# EAGLE design contactless-thermometer (EAGLE 9.6.2)
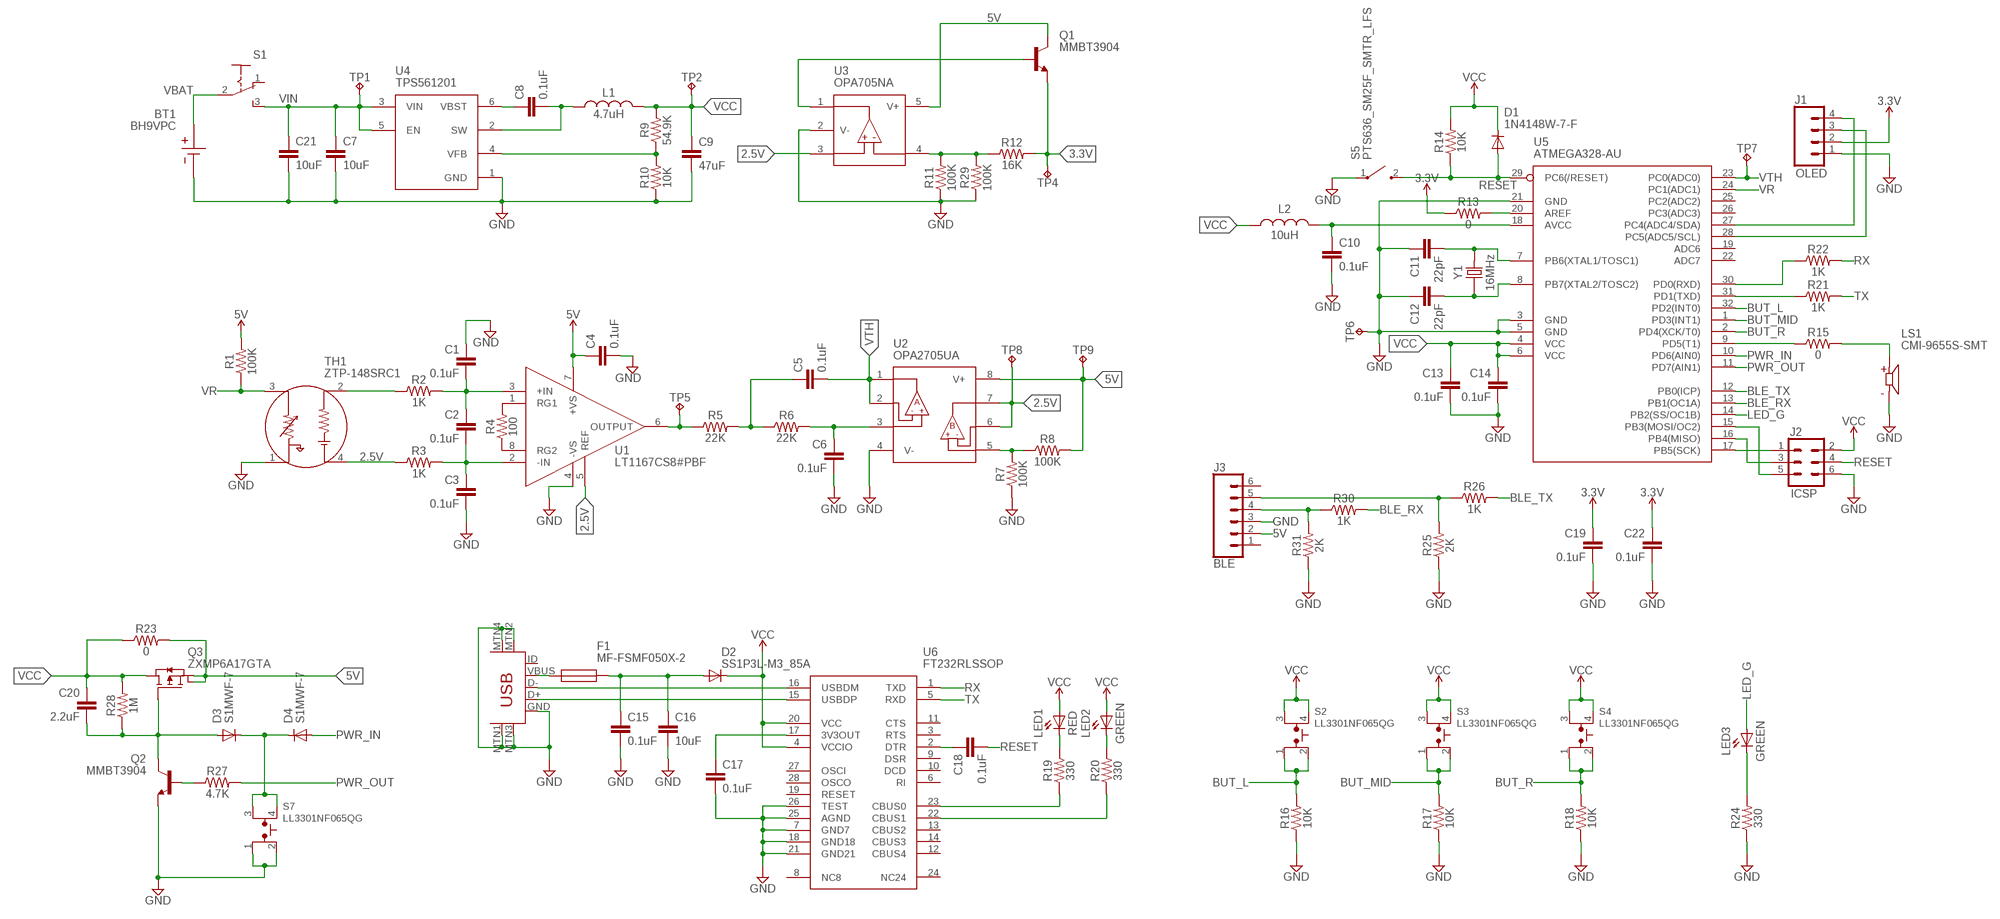
[diagram p0: schematic, sheet 1]

## Parts
BT1  BH9VPC  [BAT_BH9VPC]
C1  0.1uF  0.1UF-0603-25V-(+80/-20%)  [0603]
C2  0.1uF  0.1UF-0603-25V-(+80/-20%)  [0603]
C3  0.1uF  0.1UF-0603-25V-(+80/-20%)  [0603]
C4  0.1uF  0.1UF-0603-25V-(+80/-20%)  [0603]
C5  0.1uF  0.1UF-0603-25V-(+80/-20%)  [0603]
C6  0.1uF  0.1UF-0603-25V-(+80/-20%)  [0603]
C7  10uF  GRM21BR6YA106KE43L  [CAPC2012X145N]
C8  0.1uF  0.1UF-0603-25V-(+80/-20%)  [0603]
C9  47uF  10UF-1206-6.3V-20%  [1206]
C10  0.1uF  0.1UF-0603-25V-(+80/-20%)  [0603]
C11  22pF  0.1UF-0603-25V-(+80/-20%)  [0603]
C12  22pF  0.1UF-0603-25V-(+80/-20%)  [0603]
C13  0.1uF  0.1UF-0603-25V-(+80/-20%)  [0603]
C14  0.1uF  0.1UF-0603-25V-(+80/-20%)  [0603]
C15  0.1uF  0.1UF-0603-25V-(+80/-20%)  [0603]
C16  10uF  10UF-1206-6.3V-20%  [1206]
C17  0.1uF  0.1UF-0603-25V-(+80/-20%)  [0603]
C18  0.1uF  0.1UF-0603-25V-(+80/-20%)  [0603]
C19  0.1uF  0.1UF-0603-25V-(+80/-20%)  [0603]
C20  2.2uF  GRM21BR6YA106KE43L  [CAPC2012X145N]
C21  10uF  GRM21BR6YA106KE43L  [CAPC2012X145N]
C22  0.1uF  0.1UF-0603-25V-(+80/-20%)  [0603]
D1  1N4148W-7-F  [SOD3716X145N]
D2  SS1P3L-M3_85A  [SMP]
D3  S1MWF-7  [SODFL3518X115N]
D4  S1MWF-7  [SODFL3518X115N]
F1  MF-FSMF050X-2  [FUSC1608X100N]
J1  OLED  CONN_04  [1X04]
J2  ICSP  CONN_03X22X3_SILK_MALE_PTH  [2X3]
J3  BLE  CONN_06SILK_FEMALE_PTH  [1X06]
J4  USB-MINIB-5PIN  [USB-MINIB]
L1  4.7uH  VLCF5020T-4R7N1R7-1  [VLCF5020T4R7N1R71]
L2  10uH  LBC2012T100K  [INDC2012X145N]
LED1  RED  AA1608CGSK  [AA1608CGSK]
LED2  GREEN  AA1608CGSK  [AA1608CGSK]
LED3  GREEN  AA1608CGSK  [AA1608CGSK]
LS1  CMI-9655S-SMT  [CUI_CMI-9655S-SMT]
Q1  MMBT3904  [SOT23_NXP]
Q2  MMBT3904  [SOT23_NXP]
Q3  ZXMP6A17GTA  [SOT230P700X180-4N]
R1  100K  RESISTOR0603  [0603]
R2  1K  RESISTOR0603  [0603]
R3  1K  RESISTOR0603  [0603]
R4  100  RESISTOR0603  [0603]
R5  22K  RESISTOR0603  [0603]
R6  22K  RESISTOR0603  [0603]
R7  100K  RESISTOR0603  [0603]
R8  100K  RESISTOR0603  [0603]
R9  54.9K  RESISTOR0603  [0603]
R10  10K  RESISTOR0603  [0603]
R11  100K  RESISTOR0603  [0603]
R12  16K  RESISTOR0603  [0603]
R13  0  RESISTOR0603  [0603]
R14  10K  RESISTOR0603  [0603]
R15  0  RESISTOR0603  [0603]
R16  10K  RESISTOR0603  [0603]
R17  10K  RESISTOR0603  [0603]
R18  10K  RESISTOR0603  [0603]
R19  330  RESISTOR0603  [0603]
R20  330  RESISTOR0603  [0603]
R21  1K  RESISTOR0603  [0603]
R22  1K  RESISTOR0603  [0603]
R23  0  RESISTOR0603  [0603]
R24  330  RESISTOR0603  [0603]
R25  2K  RESISTOR0603  [0603]
R26  1K  RESISTOR0603  [0603]
R27  4.7K  RESISTOR0603  [0603]
R28  1M  RESISTOR0603  [0603]
R29  100K  RESISTOR0603  [0603]
R30  1K  RESISTOR0603  [0603]
R31  2K  RESISTOR0603  [0603]
S1  SK12F17G7  [SW3_2F17G7_CNK]
S2  LL3301NF065QG  [LL3301NF065QG]
S3  LL3301NF065QG  [LL3301NF065QG]
S4  LL3301NF065QG  [LL3301NF065QG]
S5  PTS636_SM25F_SMTR_LFS  [PTS636SM25FSMTRLFS]
S7  LL3301NF065QG  [LL3301NF065QG]
TH1  ZTP-148SRC1  [XDCR_ZTP-148SRC1]
TP1  TPTP10R  [TP10R]
TP2  TPTP10R  [TP10R]
TP4  TPTP10R  [TP10R]
TP5  TPTP10R  [TP10R]
TP6  TPTP10R  [TP10R]
TP7  TPTP10R  [TP10R]
TP8  TPTP10R  [TP10R]
TP9  TPTP10R  [TP10R]
U1  LT1167CS8#PBF  [SOIC127P599X175-8N]
U2  OPA2705UA  [SOIC127P600X175-8N]
U3  OPA705NA  OPA705NA_3K  [SOT95P280X145-5N]
U4  TPS561201  TPS561201DDCR  [SOT95P280X110-6N]
U5  ATMEGA328-AU  MEGA8-AI  [TQFP32-08]
U6  FT232RLSSOP  [SOP65P780X200-28N]
Y1  16MHz  ECS-240-20-5PX-TR  [XTAL_ECS-240-20-5PX-TR]

## Nets
2.5V: R3.1 TH1.4(THERMOPILE_GND) TP8.TP U1.5(REF) U2.6(-INB) U2.7(OUTB) U3.3(+IN)
3.3V: C19.1 C22.1 J1.2 Q1.2 R12.2 R13.1 TP4.TP
5V: C4.1 J3.2 Q1.3 Q3.2(D1) Q3.4(D2) R1.2 R8.2 R23.2 TP9.TP U1.7(+VS) U2.8(V+) U3.5(V+)
AVCC: C10.1 L2.2 U5.18(AVCC)
BLE_RX: R30.2 U5.13(PB1(OC1A))
BLE_TX: R26.2 U5.12(PB0(ICP))
BUT_L: R16.2 S2.1 S2.2 U5.32(PD2(INT0))
BUT_MID: R17.2 S3.1 S3.2 U5.1(PD3(INT1))
BUT_R: R18.2 S4.1 S4.2 U5.2(PD4(XCK/T0))
BUZZ: R15.1 U5.9(PD5(T1))
DTR: C18.1 U6.2(DTR)
GND: BT1.- C1.1 C3.2 C4.2 C6.2 C7.1 C9.2 C10.2 C11.1 C12.1 C13.2 C14.2 C15.2 C16.2 C17.2 C19.2 C21.1 C22.2 J1.1 J2.6 J3.3 J4.GND J4.MTN1(MTN2) J4.MTN2(MTN3) J4.MTN3(MTN1) J4.MTN4 LS1.N Q2.2 R7.1 R10.1 R11.1 R16.1 R17.1 R18.1 R24.1 R25.1 R29.1 R31.1 S5.1(COM) S7.1 S7.2 TH1.1(THERMISTOR_GND) TP6.TP U1.4(-VS) U2.4(V-) U3.2(V-) U4.1(GND) U5.3(GND) U5.5(GND) U5.21(GND) U6.7(GND7) U6.18(GND18) U6.21(GND21) U6.25(AGND) U6.26(TEST)
LED_G: LED3.2(A) U5.14(PB2(SS/OC1B))
N$1: C1.2 C2.1 R2.2 U1.3(+IN)
N$2: R4.2 U1.1(RG1)
N$3: R2.1 TH1.2(THERMOPILE)
N$5: C2.2 C3.1 R3.2 U1.2(-IN)
N$6: R7.2 R8.1 U2.5(+INB)
N$7: R4.1 U1.8(RG2)
N$8: R5.1 TP5.TP U1.6(OUTPUT)
N$9: LS1.P R15.2
N$10: C5.1 R5.2 R6.1
N$11: C6.1 R6.2 U2.3(+INA)
N$12: R13.2 U5.20(AREF)
N$13: J4.D- U6.16(USBDM)
N$14: J4.D+ U6.15(USBDP)
N$15: J2.1 U5.17(PB5(SCK))
N$16: C8.1 U4.6(VBST)
N$17: C11.2 U5.7(PB6(XTAL1/TOSC1)) Y1.2
N$18: C12.2 U5.8(PB7(XTAL2/TOSC2)) Y1.1
N$19: J2.3 U5.16(PB4(MISO))
N$20: C8.2 L1.1 U4.2(SW)
N$21: J2.5 U5.15(PB3(MOSI/OC2))
N$22: R9.1 R10.2 U4.4(VFB)
N$23: R11.2 R12.1 R29.2 U3.4(-IN)
N$24: R19.1 U6.23(CBUS0)
N$25: J1.4 U5.27(PC4(ADC4/SDA))
N$26: LED1.1(K) R19.2
N$27: R20.1 U6.22(CBUS1)
N$28: J1.3 U5.28(PC5(ADC5/SCL))
N$29: LED2.1(K) R20.2
N$30: C17.1 U6.17(3V3OUT)
N$31: F1.1 J4.VBUS
N$32: Q1.1 U3.1(OUT)
N$33: C15.1 C16.1 D2.1(A) F1.2
N$34: R21.1 U5.31(PD1(TXD))
N$35: R22.1 U5.30(PD0(RXD))
N$36: J3.4 R30.1 R31.2
N$37: Q2.1 R27.1
N$38: LED3.1(K) R24.2
N$39: J3.5 R25.2 R26.1
N$44: C20.1 D3.2(A) Q2.3 Q3.1(G) R28.1
N$45: D3.1(K) D4.1(K) S7.3 S7.4
PWR_IN: D4.2(A) U5.10(PD6(AIN0))
PWR_OUT: R27.2 U5.11(PD7(AIN1))
RESET: C18.2 D1.2(A) J2.4 R14.1 S5.2(NO) U5.29(PC6(/RESET))
RX: R22.2 U6.1(TXD)
TX: R21.2 U6.5(RXD)
VBAT: BT1.+ S1.2
VCC: C9.1 C13.1 C14.1 C20.2 D1.1(K) D2.2(K) J2.2 L1.2 L2.1 LED1.2(A) LED2.2(A) Q3.3(S) R9.2 R14.2 R23.1 R28.2 S2.3 S2.4 S3.3 S3.4 S4.3 S4.4 TP2.TP U5.4(VCC) U5.6(VCC) U6.4(VCCIO) U6.20(VCC)
VIN: C7.2 C21.2 S1.3 TP1.TP U4.3(VIN) U4.5(EN)
VR: R1.1 TH1.3(THERMISTOR) U5.24(PC1(ADC1))
VTH: C5.2 TP7.TP U2.1(OUTA) U2.2(-INA) U5.23(PC0(ADC0))
Unconnected: J3.1 J3.6 J4.ID S1.1 U5.19(ADC6) U5.22(ADC7) U5.25(PC2(ADC2)) U5.26(PC3(ADC3)) U6.3(RTS) U6.6(RI) U6.8(NC8) U6.9(DSR) U6.10(DCD) U6.11(CTS) U6.12(CBUS4) U6.13(CBUS2) U6.14(CBUS3) U6.19(RESET) U6.24(NC24) U6.27(OSCI) U6.28(OSCO)

## Library data of the parts
BT1 = BH9VPC:BH9VPC: 9V Battery Holder; DESCRIPTION: Battery Holder (Open) 9V 1 Cell PC Pin; DIGI-KEY_PART_NUMBER: BH9V-PC-ND; MF: MPD; MP: BH9VPC; PACKAGE: None; PURCHASE-URL: https://pricing.snapeda.com/search/part/BH9VPC/?ref=eda
C1-C6 C8 C10 C13-C15 C17-C19 C22 = SparkFun-Capacitors:0.1UF: 0.1µF ceramic capacitors A capacitor is a passive two-terminal electrical component used to store electrical energy temporarily in an electric field.; PROD_ID: CAP-00810
C7 C20 C21 = GRM21BR6YA106KE43L:GRM21BR6YA106KE43L: Check prices <https://pricing.snapeda.com/parts/GRM21BR6YA106KE43L/Murata/view-part?ref=eda>; AVAILABILITY: Good; DESCRIPTION: 0805 35 V 10 uF ±10% Tolerance X5R Multilayer Ceramic Capacitor; MF: Murata; MP: GRM21BR6YA106KE43L; PACKAGE: 2012 Murata; PRICE: None; PURCHASE-URL: https://pricing.snapeda.com/search/part/GRM21BR6YA106KE43L/?ref=eda
C9 = SparkFun-Capacitors:10UF: 10.0µF ceramic capacitors A capacitor is a passive two-terminal electrical component used to store electrical energy temporarily in an electric field.; PROD_ID: CAP-10057; VALUE: 10uF
C11 C12 = SparkFun-Capacitors:0.1UF: 0.1µF ceramic capacitors A capacitor is a passive two-terminal electrical component used to store electrical energy temporarily in an electric field.; PROD_ID: CAP-00810; VALUE: 0.1uF
C16 = SparkFun-Capacitors:10UF: 10.0µF ceramic capacitors A capacitor is a passive two-terminal electrical component used to store electrical energy temporarily in an electric field.; PROD_ID: CAP-10057
D1 = SamacSys_Parts:1N4148W-7-F: Diode Switching 150mA 100V 400mW SOD123 Diodes Inc 1N4148W-7-F Switching Diode 100V, 2-Pin SOD-123 Source: Datasheet <https://componentsearchengine.com/Datasheets/2/1N4148W-7-F.pdf>; DESCRIPTION: Diode Switching 150mA 100V 400mW SOD123 Diodes Inc 1N4148W-7-F Switching Diode 100V, 2-Pin SOD-123; HEIGHT: 1.45mm; MANUFACTURER_NAME: Diodes Inc.; MANUFACTURER_PART_NUMBER: 1N4148W-7-F; MOUSER_PART_NUMBER: 621-1N4148W-F; MOUSER_PRICE-STOCK: https://www.mouser.co.uk/ProductDetail/Diodes-Incorporated/1N4148W-7-F?qs=LHX0FizJzg7Ae9ZM8LTAWw%3D%3D
D2 = SamacSys_Parts:SS1P3L-M3_85A: Schottky Diodes & Rectifiers 30volt 1.0amp Source: Datasheet <https://www.vishay.com/docs/88915/ss1p3l.pdf>; DESCRIPTION: Schottky Diodes & Rectifiers 30volt 1.0amp; HEIGHT: mm; MANUFACTURER_NAME: Vishay; MANUFACTURER_PART_NUMBER: SS1P3L-M3/85A; MOUSER_PART_NUMBER: 625-SS1P3L-M3/85A; MOUSER_PRICE-STOCK: https://www.mouser.co.uk/ProductDetail/Vishay-General-Semiconductor/SS1P3L-M3-85A?qs=HSPD0Bff7iYLtqq1%2F0B2Eg%3D%3D
D3 D4 = SamacSys_Parts:S1MWF-7: Diode Switching 1KV 1A Automotive 2-Pin SOD-123F T/R Source: Datasheet <https://www.arrow.com/en/products/s1mwf-7/diodes-incorporated>; DESCRIPTION: Diode Switching 1KV 1A Automotive 2-Pin SOD-123F T/R; HEIGHT: 1.15mm; MANUFACTURER_NAME: Diodes Inc.; MANUFACTURER_PART_NUMBER: S1MWF-7; MOUSER_PART_NUMBER: 621-S1MWF-7; MOUSER_PRICE-STOCK: https://www.mouser.co.uk/ProductDetail/Diodes-Incorporated/S1MWF-7?qs=s5XU71A7K7%2FWPoeHvtFM6A%3D%3D
F1 = SamacSys_Parts:MF-FSMF050X-2: 0603 PTC Resettable Fuses, 6V, 500mA Bourns 0.5A Surface Mount Resettable Fuse, 6 V Source: Datasheet; DESCRIPTION: 0603 PTC Resettable Fuses, 6V, 500mA Bourns 0.5A Surface Mount Resettable Fuse, 6 V; HEIGHT: 1mm; MANUFACTURER_NAME: Bourns; MANUFACTURER_PART_NUMBER: MF-FSMF050X-2; MOUSER_PART_NUMBER: 652-MFFSMF050X-2; MOUSER_PRICE-STOCK: https://www.mouser.co.uk/ProductDetail/Bourns/MF-FSMF050X-2?qs=3QkGRBNOvbrZekaW8Gqm4A%3D%3D
J1 = SparkFun-Connectors:CONN_04: Multi connection point. Often used as Generic Header-pin footprint for 0.1 inch spaced/style header connections On any of the 0.1 inch spaced packages, you can populate with these: Break Away Headers - Straight <https://www.sparkfun.com/products/116> (PRT-00116) Break Away Male Headers - Right Angle <https://www.sparkfun.com/products/553> (PRT-00553) Female Headers <https://www.sparkfun.com/products/115> (PRT-00115) Break Away Headers - Machine Pin <https://www.sparkfun.com/products/117> (PRT-00117) Break Away Female Headers - Swiss Machine Pin <https://www.sparkfun.com/products/743> (PRT-00743) For SCREWTERMINALS and SPRING TERMINALS visit here: Screw Terimnals on SparkFun.com <https://www.sparkfun.com/search/results?term=Screw+Terminals> (5mm/3.5mm/2.54mm spacing) This device is also useful as a general connection point to wire up your design to another part of your project. Our various solder wires solder well into these plated through hole pads. Hook-Up Wire - Assortment (Stranded, 22 AWG) <https://www.sparkfun.com/products/11375> (PRT-11375) Hook-Up Wire - Assortment (Solid Core, 22 AWG) <https://www.sparkfun.com/products/11367> (PRT-11367) View the entire wire category on our website here <https://www.sparkfun.com/categories/141> Special notes: Molex polarized connector foot print use with SKU : PRT-08231 with associated crimp pins and housings. 1MM SMD Version SKU: PRT-10208; PROD_ID: CONN-09696
J2 = SparkFun-Connectors:CONN_03X2: Multi connection point. Often used as Generic Header-pin footprint for 0.1 inch spaced/style header connections You can populate with any combo of single row headers, but if you'd like an exact match, check these: Header - 2x3 (Male, 0.1") <https://www.sparkfun.com/products/12807> (PRT-12807) Header - 2x3 (Female, 0.1") <https://www.sparkfun.com/products/13010> (PRT-13010) 2x3 Pin Shrouded Header <https://www.sparkfun.com/products/10877> (PRT-10877) On any of the 0.1 inch spaced packages, you can populate with these: Break Away Headers - Straight <https://www.sparkfun.com/products/116> (PRT-00116) Break Away Male Headers - Right Angle <https://www.sparkfun.com/products/553> (PRT-00553) Female Headers <https://www.sparkfun.com/products/115> (PRT-00115) Break Away Headers - Machine Pin <https://www.sparkfun.com/products/117> (PRT-00117) Break Away Female Headers - Swiss Machine Pin <https://www.sparkfun.com/products/743> (PRT-00743) Special note: the shrouded connector mates well with our 3x2 ribbon cables: Ribbon Crimp Connector - 6-pin (2x3, Female) <https://www.sparkfun.com/products/10651> (PRT-10651) Ribbon Cable - 6 wire (15ft) <https://www.sparkfun.com/products/10646> (PRT-10646); PROD_ID: CONN-09701
J3 = SparkFun-Connectors:CONN_06: Multi connection point. Often used as Generic Header-pin footprint for 0.1 inch spaced/style header connections On any of the 0.1 inch spaced packages, you can populate with these: Break Away Headers - Straight <https://www.sparkfun.com/products/116> (PRT-00116) Break Away Male Headers - Right Angle <https://www.sparkfun.com/products/553> (PRT-00553) Female Headers <https://www.sparkfun.com/products/115> (PRT-00115) Break Away Headers - Machine Pin <https://www.sparkfun.com/products/117> (PRT-00117) Break Away Female Headers - Swiss Machine Pin <https://www.sparkfun.com/products/743> (PRT-00743) Arduino Stackable Header - 6 Pin <https://www.sparkfun.com/products/9280> (PRT-09280) For SCREWTERMINALS and SPRING TERMINALS visit here: Screw Terimnals on SparkFun.com <https://www.sparkfun.com/search/results?term=Screw+Terminals> (5mm/3.5mm/2.54mm spacing) This device is also useful as a general connection point to wire up your design to another part of your project. Our various solder wires solder well into these plated through hole pads. Hook-Up Wire - Assortment (Stranded, 22 AWG) <https://www.sparkfun.com/products/11375> (PRT-11375) Hook-Up Wire - Assortment (Solid Core, 22 AWG) <https://www.sparkfun.com/products/11367> (PRT-11367) View the entire wire category on our website here <https://www.sparkfun.com/categories/141>; PROD_ID: CONN-08437
J4 = SparkFun:USB-MINIB: Mini-USB "B" connector with 5th pin broken out. Created new symbol breaking out 5th "ID" pin in mini/micro USB connector spec. See: http://en.wikipedia.org/wiki/Mini_usb#Cables. Uses same footprint as 4-pin symbol. Also added pins to connect to mounting / shield pads if required (probably not generally needed as signals aren't shielded once they leave the connector).
L1 = SamacSys_Parts:VLCF5020T-4R7N1R7-1: TDK VLC5020 Series Shielded Wire-wound SMD Inductor 4.7 uH +/-30% 2.09A Idc Source: Datasheet <https://componentsearchengine.com/Datasheets/1/VLCF5020T-4R7N1R7-1.pdf>; DESCRIPTION: TDK VLC5020 Series Shielded Wire-wound SMD Inductor 4.7 uH +/-30% 2.09A Idc; HEIGHT: 2mm; MANUFACTURER_NAME: TDK; MANUFACTURER_PART_NUMBER: VLCF5020T-4R7N1R7-1; MOUSER_PART_NUMBER: 810-VLCF52T4R7N1R71; MOUSER_PRICE-STOCK: https://www.mouser.co.uk/ProductDetail/TDK/VLCF5020T-4R7N1R7-1?qs=9dFQwQorgSwYqTIMbazytg%3D%3D
L2 = LBC2012T100K:LBC2012T100K: INDUCTOR, 10UH, 0.2A, 10%, 40MHz; Product Range:TAIYO YUDEN - LBC Series 2012 (0805) Wirewound Chip Inductors; Inductance:10µH; Inductance Tolerance:± 10%; DC Resistance Max:1.2ohm; DC Current Rating:200mA; Inductor Case Style:0805 ;RoHS Compliant: Yes; DESCRIPTION: 10µH Unshielded Wirewound Inductor 200mA 1.2Ohm 0805 (2012 Metric); DIGI-KEY_PART_NUMBER: 587-2530-1-ND; MF: Taiyo Yuden; MP: LBC2012T100K; PACKAGE: 2012 Taiyo Yuden
LED1-LED3 = SamacSys_Parts:AA1608CGSK: Standard LEDs - SMD Green LED Source: Datasheet; DESCRIPTION: Standard LEDs - SMD Green LED; HEIGHT: 0.65mm; MANUFACTURER_NAME: Kingbright; MANUFACTURER_PART_NUMBER: AA1608CGSK; MOUSER_PART_NUMBER: 604-AA1608CGSK; MOUSER_PRICE-STOCK: https://www.mouser.co.uk/ProductDetail/Kingbright/AA1608CGSK?qs=eP2BKZSCXI5BYF2DjL8nRw%3D%3D
LS1 = CMI-9655S-SMT:CMI-9655S-SMT: 9.6 mm, 5 Vdc, 85 dB, 2.7 kHz, Surface Mount (SMT), Driving Circuit, Magnetic Audio Indicator Buzzer Check prices <https://pricing.snapeda.com/parts/CMI-9655S-SMT-TR/CUI%20Devices/view-part?ref=eda>; AVAILABILITY: Good; CUI_PURCHASE_URL: https://www.cuidevices.com/product/audio/buzzers/audio-indicators/cmi-9655s-smt-tr?utm_source=snapeda.com&utm_medium=referral&utm_campaign=snapedaBOM; DESCRIPTION: 9.6 mm, 5 Vdc, 85 dB, 2.7 kHz, Surface Mount (SMT), Driving Circuit, Magnetic Audio Indicator Buzzer; MF: CUI Devices; MP: CMI-9655S-SMT-TR; PACKAGE: CUI Inc.; PRICE: None; PURCHASE-URL: https://pricing.snapeda.com/search/part/CMI-9655S-SMT-TR/?ref=eda
Q1 Q2 = MMBT3904:MMBT3904; BUILT_BY: EMA_UL_Team; MANUFACTURER_PART_NUMBER: MMBT3904; SOURCELIBRARY: NXP_2011-11-10; VENDOR: NXP
Q3 = SamacSys_Parts:ZXMP6A17GTA: ZXMP6A17GTA P-Channel MOSFET, 4.3 A, 60 V, 3 + Tab-Pin SOT-223 Diodes Inc Source: Datasheet <https://www.diodes.com/assets/Datasheets/ZXMP6A17G.pdf>; DESCRIPTION: ZXMP6A17GTA P-Channel MOSFET, 4.3 A, 60 V, 3 + Tab-Pin SOT-223 Diodes Inc; HEIGHT: 1.8mm; MANUFACTURER_NAME: Diodes Inc.; MANUFACTURER_PART_NUMBER: ZXMP6A17GTA; MOUSER_PART_NUMBER: 522-ZXMP6A17GTA; MOUSER_PRICE-STOCK: https://www.mouser.co.uk/ProductDetail/Diodes-Incorporated/ZXMP6A17GTA/?qs=4zh0VFflF2FGsnVH%252BQc2hw%3D%3D
R1-R31 = SparkFun-Resistors:RESISTOR: Generic Resistor Package
S1 = SK12F17G7:SK12F17G7; BUILT_BY: EMA_Matt; COPYRIGHT: Copyright (C) 2018 Accelerated Designs. All rights reserved; DATASHEET: https://www.ckswitches.com/media/1432/sk.pdf; MANUFACTURER_PART_NUMBER: SK12F17G7; SOURCELIBRARY: Add_to_database_2020-11-12; VENDOR: C&K
S2-S4 S7 = SamacSys_Parts:LL3301NF065QG: E-SWITCH - LL3301NF065QG - TACTILE SW, SPST, 0.05A, 12VDC, SOLDER Source: Datasheet <http://spec_sheets.e-switch.com/specs/P090002.pdf>; DESCRIPTION: E-SWITCH - LL3301NF065QG - TACTILE SW, SPST, 0.05A, 12VDC, SOLDER; HEIGHT: 4mm; MANUFACTURER_NAME: E-Switch; MANUFACTURER_PART_NUMBER: LL3301NF065QG; MOUSER_PART_NUMBER: 612-LL3301NF065QG; MOUSER_PRICE-STOCK: https://www.mouser.co.uk/ProductDetail/E-Switch/LL3301NF065QG/?qs=QtyuwXswaQiWhwgY68YTTw%3D%3D
S5 = SamacSys_Parts:PTS636_SM25F_SMTR_LFS: Tactile Switches Tact 50mA 12VDC, 6.0x3.5, 2.5mm H, 180gf, F leads, No ground pin, White Actuator Source: Datasheet <https://ms.componentsearchengine.com/Datasheets/1/PTS636 SM25F SMTR LFS.pdf>; DESCRIPTION: Tactile Switches Tact 50mA 12VDC, 6.0x3.5, 2.5mm H, 180gf, F leads, No ground pin, White Actuator; HEIGHT: 2.7mm; MANUFACTURER_NAME: C & K COMPONENTS; MANUFACTURER_PART_NUMBER: PTS636 SM25F SMTR LFS; MOUSER_PART_NUMBER: 611-PTS636SM25FSMTRL; MOUSER_PRICE-STOCK: https://www.mouser.co.uk/ProductDetail/CK/PTS636-SM25F-SMTR-LFS?qs=vLWxofP3U2wcBTQSwfMFOw%3D%3D
TH1 = ZTP-148SRC1:ZTP-148SRC1: Temperature Sensor Analog, Infrared (IR) -20C - 100C TO-46-4; DESCRIPTION: Temperature Sensor Analog, Infrared (IR) -20°C ~ 100°C TO-46-4; DIGI-KEY_PART_NUMBER: 45-ZTP-148SRC1-ND; MF: Amphenol Advanced Sensors; MP: ZTP-148SRC1; PACKAGE: None; PURCHASE-URL: https://pricing.snapeda.com/search/part/ZTP-148SRC1/?ref=eda
TP1 TP2 TP4-TP9 = testpad:TP: Test pad
U1 = SamacSys_Parts:LT1167CS8#PBF: LINEAR TECHNOLOGY - LT1167CS8#PBF - Programmable/Variable Amplifier, 1 Channels, 1 Amplifier, 1 MHz, 0 C, 70 C, +/- 2.3V to +/- 18V Source: Datasheet <https://componentsearchengine.com/Datasheets/2/LT1167CS8#PBF.pdf>; DESCRIPTION: LINEAR TECHNOLOGY - LT1167CS8#PBF - Programmable/Variable Amplifier, 1 Channels, 1 Amplifier, 1 MHz, 0 C, 70 C, +/- 2.3V to +/- 18V; HEIGHT: 1.752mm; MANUFACTURER_NAME: Linear Technology; MANUFACTURER_PART_NUMBER: LT1167CS8#PBF; MOUSER_PART_NUMBER: 584-LT1167CS8#PBF; MOUSER_PRICE-STOCK: https://www.mouser.co.uk/ProductDetail/Analog-Devices-Linear-Technology/LT1167CS8PBF?qs=ytflclh7QUUVpzBAXM50AA%3D%3D
U2 = SamacSys_Parts:OPA2705UA: Texas Instruments OPA2705UA, Dual Op Amp, 1MHz CMOS, Rail to Rail, 5 V, 9 V, 8-Pin SOIC Source: Datasheet <http://www.ti.com/lit/ds/symlink/opa2705.pdf>; DESCRIPTION: Texas Instruments OPA2705UA, Dual Op Amp, 1MHz CMOS, Rail to Rail, 5 V, 9 V, 8-Pin SOIC; HEIGHT: 1.75mm; MANUFACTURER_NAME: Texas Instruments; MANUFACTURER_PART_NUMBER: OPA2705UA; MOUSER_PART_NUMBER: 595-OPA2705UA; MOUSER_PRICE-STOCK: https://www.mouser.com/Search/Refine.aspx?Keyword=595-OPA2705UA
U3 = SamacSys_Parts:OPA705NA_3K: 12V, Low Cost, CMOS, Rail-to-Rail I/O, Operational Amplifier Source: Datasheet <http://www.ti.com/lit/gpn/opa705>; DESCRIPTION: 12V, Low Cost, CMOS, Rail-to-Rail I/O, Operational Amplifier; HEIGHT: mm; MANUFACTURER_NAME: Texas Instruments; MANUFACTURER_PART_NUMBER: OPA705NA/3K; MOUSER_PART_NUMBER: 595-OPA705NA/3K; MOUSER_PRICE-STOCK: https://www.mouser.co.uk/ProductDetail/Texas-Instruments/OPA705NA-3K?qs=wgAEGBTxy7nCp5M53cdWcg%3D%3D
U4 = SamacSys_Parts:TPS561201DDCR: 4.5V to 17V Input, 1A Synchronous Step-Down Voltage Regulator in 6-pin SOT-23 Source: Datasheet <http://www.ti.com/lit/gpn/tps561201>; DESCRIPTION: 4.5V to 17V Input, 1A Synchronous Step-Down Voltage Regulator in 6-pin SOT-23; HEIGHT: 1.1mm; MANUFACTURER_NAME: Texas Instruments; MANUFACTURER_PART_NUMBER: TPS561201DDCR; MOUSER_PART_NUMBER: 595-TPS561201DDCR; MOUSER_PRICE-STOCK: https://www.mouser.co.uk/ProductDetail/Texas-Instruments/TPS561201DDCR?qs=5aG0NVq1C4ySUOSRQSt9MQ%3D%3D
U5 = atmel:MEGA8: MICROCONTROLLER 8 Kbytes FLASH, 1 kbytes SRAM, 512 bytes EEPROM, USART, 6-channel 10 bit ADC, 2-channel 8 bit ADC Pin compatible with Atmega48, ATMega88, ATMega168 Source: avr.lbr; MPN: ATMEGA8-16AU; OC_FARNELL: 9171371; OC_NEWARK: 73M8863
U6 = SamacSys_Parts:FT232RLSSOP: USB Interface IC FT232R Single Ch Full Speed Source: Datasheet <http://www.ftdichip.com/Support/Documents/DataSheets/ICs/DS_FT232R.pdf>; DESCRIPTION: USB Interface IC FT232R Single Ch Full Speed; HEIGHT: 2mm; MANUFACTURER_NAME: FTDI Chip; MANUFACTURER_PART_NUMBER: FT232RL-TUBE; MOUSER_PART_NUMBER: 895-FT232RL-TUBE; MOUSER_PRICE-STOCK: https://www.mouser.co.uk/ProductDetail/FTDI/FT232RL-TUBE?qs=D1%2FPMqvA100UF95YMvGN8w%3D%3D
Y1 = ECS-240-20-5PX-TR:ECS-240-20-5PX-TR: CRYSTAL SMD; DESCRIPTION: 24MHz ±30ppm Crystal 20pF 30 Ohms HC-49/US; DIGI-KEY_PART_NUMBER: XC1255CT-ND; MF: ECS Inc.; MP: ECS-240-20-5PX-TR; PACKAGE: HC49/US ECS International; PURCHASE-URL: https://pricing.snapeda.com/search/part/ECS-240-20-5PX-TR/?ref=eda

## Board
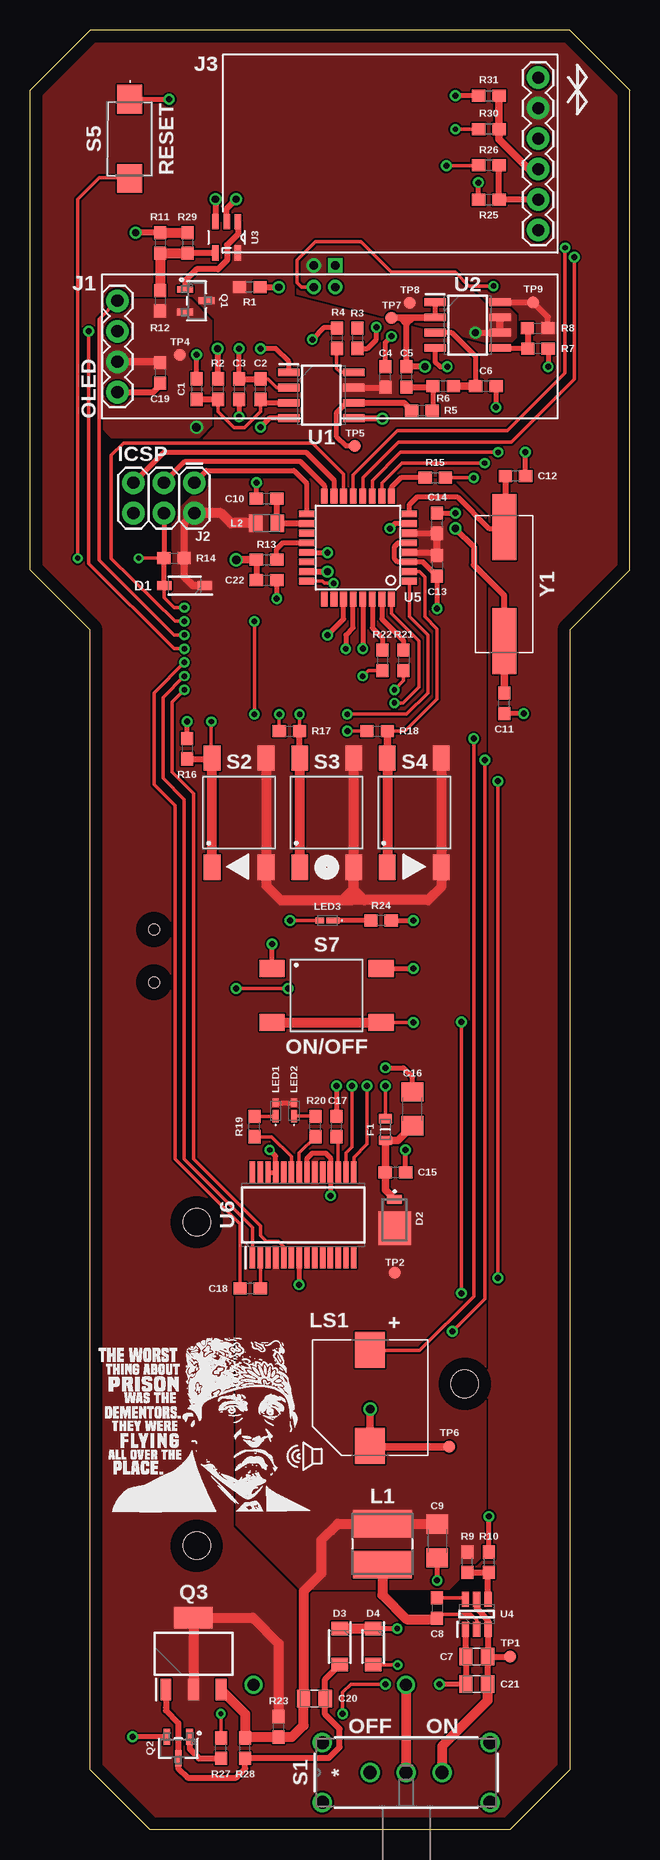
[diagram p1: board, top side]
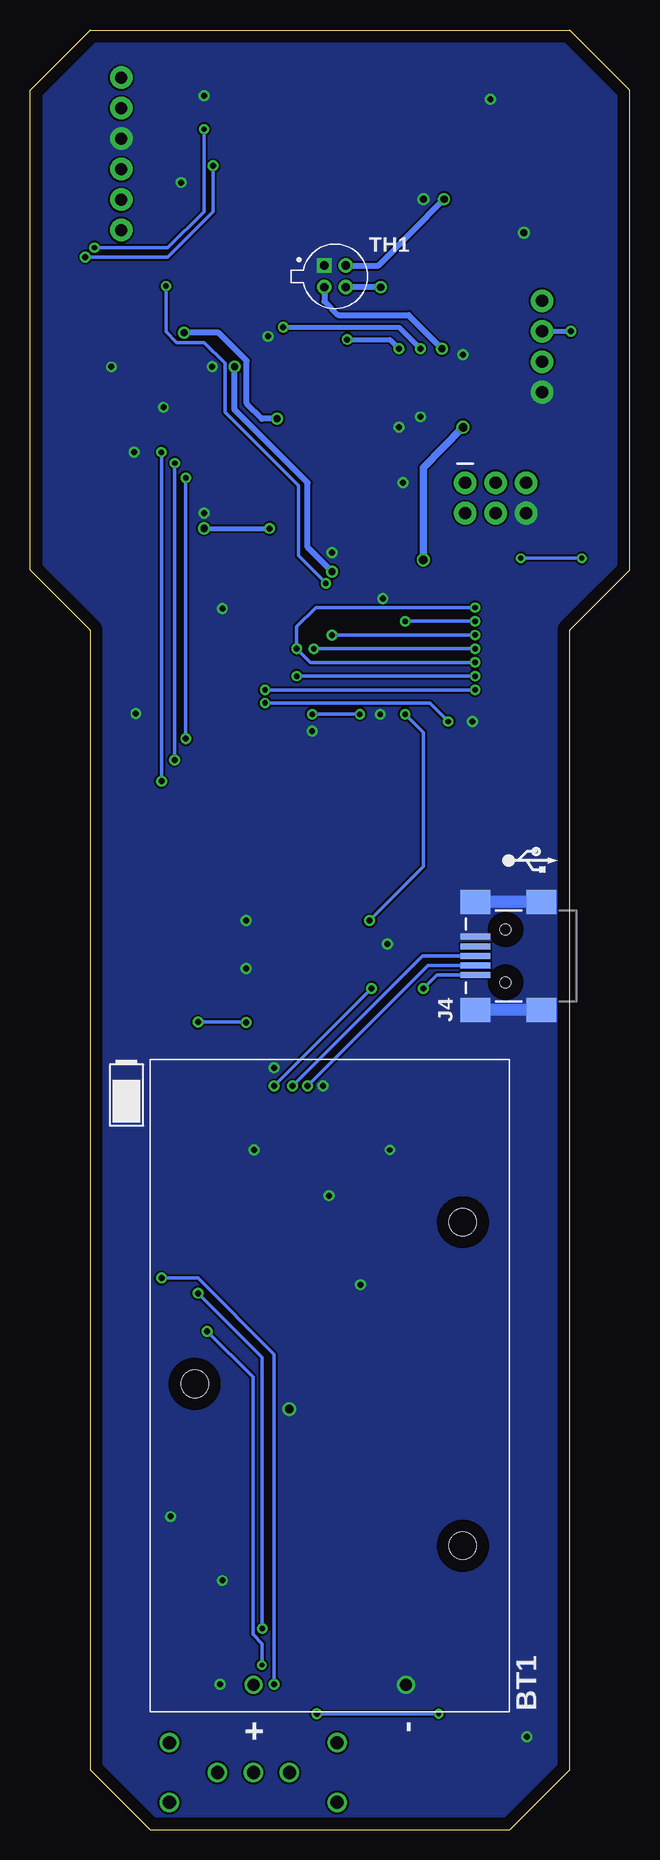
[diagram p2: board, bottom side, seen from below]

Size 50 x 150 mm. Coordinates in mm from the lower left corner, seen from the top.
Outline: 45,150 5,150 0,145 0,105 5,100 5,5 10,0 40,0 45,5 45,100 50,105 50,145 45,150
Copper layers (1*16): Top 0.035mm / dielectric 1.5mm / Bottom 0.035mm
Design rules "default": minimum track width 6mil, minimum drill 0.35mm, track to track 6mil, track to pad 6mil, pad to pad 6mil, via to via 6mil, smd to smd 6mil, copper to edge 40mil, drill to drill 6mil, minimum pad ring 10mil, minimum via ring 8mil, stop-mask expansion 4mil, vias tented up to drill 0mil, thermal gap 10mil

### Footprints (pad centres in the part's own frame; a part is rotated, then mirrored left to right if it is on the bottom)
BAT_BH9VPC = drill 1.016: + 24.945,-6.35; - 24.945,6.35 | hole 2.29: -0.135,-11.26; -13.625,11.09; 13.345,11.09
0603 = smd 1.1 x 1: 1 -0.85,0; 2 0.85,0
CAPC2012X145N = smd 1.11 x 1.47: 1 -0.9,0; 2 0.9,0
1206 = smd 1.6 x 1.8: 1 -1.4,0; 2 1.4,0
SOD3716X145N = smd 1.2 x 0.75: 1 -1.7,0; 2 1.7,0
SMP = smd 0.762 x 1.27: 1 0.03,0 | smd 2.8 x 2.7: 2 -2.362,0
SODFL3518X115N = smd 1.12 x 1.37: 1 -1.5,0; 2 1.5,0
FUSC1608X100N = smd 0.77 x 1.07: 1 -0.9,0; 2 0.9,0
1X04 = drill 1.016 pad 1.88: 1 0,0; 2 2.54,0; 3 5.08,0; 4 7.62,0
2X3 = drill 1.016 pad 1.88: 1 0,0; 2 0,2.54; 3 2.54,0; 4 2.54,2.54; 5 5.08,0; 6 5.08,2.54
1X06 = drill 1.016 pad 1.88: 1 0,0; 2 2.54,0; 3 5.08,0; 4 7.62,0; 5 10.16,0; 6 12.7,0
USB-MINIB = smd 2.5 x 0.5: D+ 2.5,0; D- 2.5,0.8; GND 2.5,-1.6; ID 2.5,-0.8; VBUS 2.5,1.6 | smd 2.5 x 2: MTN1 -3,4.5; MTN2 2.5,4.5; MTN3 -3,-4.5; MTN4 2.5,-4.5 | hole 0.9: 0,2.2; 0,-2.2
VLCF5020T4R7N1R71 = smd 4.9 x 2.3: 1 0,-1.7; 2 0,1.7
INDC2012X145N = smd 1.14 x 1.47: 1 -0.89,0; 2 0.89,0
AA1608CGSK = smd 1.05 x 0.5: 1 -0.558,0 | smd 0.7 x 0.5: 2 0.558,0
CUI_CMI-9655S-SMT = smd 2.5 x 3: N 0,-4; P 0,4
SOT23_NXP = smd 0.559 x 1.321: 1 -0.953,-0.945; 2 0.953,-0.945; 3 0,0.847
SOT230P700X180-4N = smd 1.8 x 0.9: 1 -3,2.3; 2 -3,0; 3 -3,-2.3 | smd 1.8 x 3.2: 4 3,0
SW3_2F17G7_CNK = drill 1.092 pad 1.6: 1 0,0; 2 0,-2.997; 3 0,-5.994; 4 -2.489,-10.008; 5 2.489,-10.008; 6 -2.489,3.988; 7 2.489,3.988
LL3301NF065QG = smd 2.1 x 1.4: 1 -4.55,2.25; 2 4.55,2.25; 3 -4.55,-2.25; 4 4.55,-2.25
PTS636SM25FSMTRLFS = smd 2.4 x 2.1: 1 -3.3,0; 2 3.3,0
XDCR_ZTP-148SRC1 = drill 0.7 pad 1.1 square: 1 -0.898,0.898 | drill 0.7 pad 1.1: 2 -0.898,-0.898; 3 0.898,-0.898; 4 0.898,0.898
TP10R = smd 1 x 1: TP 0,0
SOIC127P599X175-8N = smd 1.8 x 0.65: 1 -2.712,1.905; 2 -2.712,0.635; 3 -2.712,-0.635; 4 -2.712,-1.905; 5 2.712,-1.905; 6 2.712,-0.635; 7 2.712,0.635; 8 2.712,1.905
SOIC127P600X175-8N = smd 1.8 x 0.65: 1 -2.712,1.905; 2 -2.712,0.635; 3 -2.712,-0.635; 4 -2.712,-1.905; 5 2.712,-1.905; 6 2.712,-0.635; 7 2.712,0.635; 8 2.712,1.905
SOT95P280X145-5N = smd 1.27 x 0.559: 1 -1.295,0.94; 2 -1.295,0; 3 -1.295,-0.94; 4 1.295,-0.94; 5 1.295,0.94
SOT95P280X110-6N = smd 1.25 x 0.6: 1 -1.25,0.95; 2 -1.25,0; 3 -1.25,-0.95; 4 1.25,-0.95; 5 1.25,0; 6 1.25,0.95
TQFP32-08 = smd 1.27 x 0.559: 1 -4.293,2.8; 2 -4.293,2; 3 -4.293,1.2; 4 -4.293,0.4; 5 -4.293,-0.4; 6 -4.293,-1.2; 7 -4.293,-2; 8 -4.293,-2.8; 17 4.293,-2.8; 18 4.293,-2; 19 4.293,-1.2; 20 4.293,-0.4; 21 4.293,0.4; 22 4.293,1.2; 23 4.293,2; 24 4.293,2.8 | smd 0.559 x 1.27: 9 -2.8,-4.293; 10 -2,-4.293; 11 -1.2,-4.293; 12 -0.4,-4.293; 13 0.4,-4.293; 14 1.2,-4.293; 15 2,-4.293; 16 2.8,-4.293; 25 2.8,4.293; 26 2,4.293; 27 1.2,4.293; 28 0.4,4.293; 29 -0.4,4.293; 30 -1.2,4.293; 31 -2,4.293; 32 -2.8,4.293
SOP65P780X200-28N = smd 1.8 x 0.45: 1 -3.55,4.225; 2 -3.55,3.575; 3 -3.55,2.925; 4 -3.55,2.275; 5 -3.55,1.625; 6 -3.55,0.975; 7 -3.55,0.325; 8 -3.55,-0.325; 9 -3.55,-0.975; 10 -3.55,-1.625; 11 -3.55,-2.275; 12 -3.55,-2.925; 13 -3.55,-3.575; 14 -3.55,-4.225; 15 3.55,-4.225; 16 3.55,-3.575; 17 3.55,-2.925; 18 3.55,-2.275; 19 3.55,-1.625; 20 3.55,-0.975; 21 3.55,-0.325; 22 3.55,0.325; 23 3.55,0.975; 24 3.55,1.625; 25 3.55,2.275; 26 3.55,2.925; 27 3.55,3.575; 28 3.55,4.225
XTAL_ECS-240-20-5PX-TR = smd 5.5 x 2: 1 -4.75,0; 2 4.75,0

### Placement (x,y rotation side)
BT1  25,37 270 bottom
C1  13.89,120.07 270 top
C2  19.22,120.07 90 top
C3  17.45,120.07 270 top
C4  29.64,121.08 90 top
C5  31.42,121.08 90 top
C6  38.02,120.32 0 top
C7  37.26,14.4 0 top
C8  33.96,18.47 270 top
C9  33.96,24.05 270 top
C10  19.73,110.92 180 top
C11  39.54,93.88 90 top
C12  40.48,112.83 180 top
C13  33.96,105.33 270 top
C14  33.96,108.89 90 top
C15  30.48,54.79 0 top
C16  31.9,60.07 90 top
C17  25.57,58.6 90 top
C18  18.36,45.09 180 top
C19  10.84,121.41 270 top
C20  23.72,10.92 180 top
C21  37.26,12.12 0 top
C22  19.73,104.14 0 top
D1  12.9,103.68 180 top
D2  30.4,52.5 90 top
D3  25.83,15.24 270 top
D4  28.62,15.24 270 top
F1  29.64,58.34 270 top
J1  7.29,119.81 90 top
J2  13.71,112.27 180 top
J3  42.39,146.02 270 top
J4  10.33,72.82 180 bottom
L1  29.38,23.8 0 top
L2  19.73,108.89 0 top
LED1  20.49,60.02 90 top
LED2  22.02,60.02 90 top
LED3  24.71,75.77 180 top
LS1  28.37,35.99 0 top
Q1  13.89,127.43 270 top
Q2  12.37,6.78 180 top
Q3  13.64,14.66 90 top
R1  18.34,128.57 180 top
R2  15.67,120.07 270 top
R3  27.3,124.31 270 top
R4  25.62,124.31 90 top
R5  32.69,118.29 0 top
R6  34.46,120.32 0 top
R7  42.36,123.44 180 top
R8  42.34,125.15 0 top
R9  36.5,22.28 90 top
R10  38.27,22.28 270 top
R11  10.84,132.26 270 top
R12  10.84,127.43 270 top
R13  19.73,105.84 0 top
R14  12.01,105.97 0 top
R15  33.8,112.67 0 top
R16  13.1,90.09 270 top
R17  21.64,91.57 0 top
R18  28.95,91.57 0 top
R19  18.72,58.6 90 top
R20  23.8,58.6 90 top
R21  31.16,97.46 270 top
R22  29.38,97.46 270 top
R23  20.75,8.56 90 top
R24  29.28,75.77 180 top
R25  38.27,135.86 0 top
R26  38.27,138.71 180 top
R27  15.92,6.78 90 top
R28  17.95,6.78 90 top
R29  13.13,132.26 270 top
R30  38.27,141.73 180 top
R31  38.27,144.53 0 top
S1  28.37,4.75 90 top
S2  17.45,84.76 90 top
S3  24.75,84.76 90 top
S4  32.05,84.76 90 top
S5  8.3,140.92 270 top
S7  24.75,69.52 0 top
TH1  24.56,129.46 0 bottom
TP1  40.05,14.4 0 top
TP2  30.4,46.41 0 top
TP4  12.49,122.94 0 top
TP5  27.1,115.32 0 top
TP6  34.97,31.9 0 top
TP7  30.15,126.01 0 top
TP8  31.67,127.25 0 top
TP9  41.96,127.3 0 top
U1  24.3,119.56 0 top
U2  36.5,125.4 0 top
U3  16.4,132.72 270 top
U4  37.26,17.96 90 top
U5  27.35,106.86 180 top
U6  22.78,51.23 90 top
Y1  39.54,103.81 270 top

### Tracks (layer width: path | path; a pad name or v marks a point on that pad's centre or on a via)
2.5V  (via drill 0.6)
  Top 0.508: v15.46,135.89 U3.3 | U1.5 29.33,117.65 v29.38,117.6 | v37.16,124.77 U2.6
  Top 0.61: U2.7 U2.6
  Bottom 0.508: TH1.4 20.94,130.36 v15.46,135.89 | v29.38,117.6 30.65,117.6 31.92,118.87 31.92,122.43 34.26,124.77 v37.16,124.77
  pour Top (no thermals): 23.8,132.33 22.27,130.81 22.27,128.02 39.75,123.57 40.56,124.38 40.56,126.19 40,126.75 38.35,126.75 35.3,129.79 30.15,129.79 27.61,132.33
3.3V  (via drill 0.7)
  Top 0.406: 10.93,122.35 C19.1
  Top 0.508: R13.1 C22.1
  Top 0.61: J1.2 10.93,122.35 | R13.1 v17.19,105.84
  Bottom 0.61: v17.19,105.84 17.19,113.51 v13.89,116.89
  pour Top (no thermals): 7.29,127.51 5.76,125.98 5.76,117.09 6.78,116.08 14.14,116.08 15.16,117.09 15.16,125.73 13.38,127.51
5V
  Top 0.305: 29.6,120.19 C4.1
  Top 0.508: U1.7 29.6,120.19 | U2.8 TP9.TP 43.19,126.07 R8.2
  Top 0.813: Q3.2 Q3.4 18.59,17.66 20.75,15.49 R23.2
  pour Top (rank 2, no thermals): 4.75,150.11 -0.33,145.03 -0.33,105.16 4.75,100.08 4.75,4.83 9.83,-0.25 39.8,-0.25 45.13,5.08 45.13,99.82 50.21,104.9 50.21,145.29 45.39,150.11
AVCC
  Top 0.305: 20.65,108.86 L2.2 | 20.62,110.88 C10.1
  Top 0.508: U5.18 20.65,108.86 | L2.2 20.62,110.88
BLE_RX  (via drill 0.45)
  Top 0.305: v44.62,131.85 44.62,121.41 39.8,116.59 30.65,116.59 26.95,112.88 U5.13 | v35.48,141.73 R30.2
  Bottom 0.305: v44.62,131.85 38.5,131.85 35.48,134.87 v35.48,141.73
BLE_TX  (via drill 0.5)
  Top 0.305: U5.12 27.75,112.67 30.73,115.65 40.13,115.65 45.39,120.9 v45.39,131.06 | R26.2 37.42,138.68 v34.72,138.68
  Bottom 0.305: v45.39,131.06 38.53,131.06 34.72,134.87 v34.72,138.68
BUT_L  (via drill 0.45)
  Top 0.305: S2.2 15.12,89.23 v15.12,92.35 | U5.32 30.15,101.34 32.43,99.06 32.43,95.25 31.09,93.9 v30.4,93.9
  Top 0.508: R16.2 15.12,89.23
  Top 0.813: S2.1 S2.2
  Bottom 0.305: v15.12,92.35 16.66,93.9 v30.4,93.9
BUT_MID  (via drill 0.45)
  Top 0.305: U5.1 31.64,101.12 33.19,99.57 33.19,94.74 31.42,92.96 v26.46,92.96 | R17.2 v22.49,92.96
  Top 0.508: S3.2 22.5,91.51 R17.2
  Top 0.813: S3.2 S3.1
  Bottom 0.305: v22.49,92.96 v26.46,92.96
BUT_R
  Top 0.305: U5.2 32.48,104.86 32.94,104.39 32.94,101.09 33.96,100.08 33.96,94.23 31.29,91.57 R18.2
  Top 0.61: S4.2 R18.2
  Top 0.813: S4.2 S4.1
BUZZ
  Top 0.406: R15.1 30.92,112.67 30.15,111.91 U5.9
DTR
  Top 0.305: U6.2 C18.1
GND  (via drill 0.45, 0.5, 0.6, 0.7)
  Top 0.305: R18.1 v26.46,91.57 | R17.1 v20.79,92.96
  Top 0.406: v33.96,101.78 C13.2 32.78,105.66 U5.3 30.66,105.66 30.4,105.92 30.4,106.93 30.72,107.26 U5.5 | C6.2 v38.87,118.54 | C9.2 v33.96,20.75 | R10.1 v38.27,26.09 | C21.1 v34.16,12.12 | Q2.2 v8.56,7.73 | C3.2 v17.45,117.75 | C1.1 v13.89,122.94 | S7.1 v20.2,73.81 | S7.2 v31.96,71.77 | R24.1 v31.96,75.77 | U6.7 v22.45,45.42 v22.45,45.41 | U6.21 23.11,55.95 23.54,56.39 24.66,56.39 25.05,55.99 U6.18 25.05,52.84 v25.07,52.83 | U5.21 24.78,106.46 v24.81,106.43 | S5.1 v11.6,144.22 | C10.2 v18.88,112.27 | C22.2 v20.58,102.62 | C14.2 v35.48,109.74 | R16.1 v13.1,92.35 | v25.57,61.98 C17.2 | v41.17,93.02 39.56,93.02 C11.1 | C12.1 v41.32,114.81 | C15.2 v31.33,56.64 | v29.64,63.5 31.14,63.5 31.9,62.74 C16.2 | U1.4 19.99,117.65 v19.22,116.89 | U2.4 33.78,122.35 34.21,121.93 v34.79,121.93 | R7.1 v43.21,121.92 | C4.2 29.64,123.95 v30.15,124.46 | R25.1 37.38,135.9 v37.38,137.29 | R31.1 v35.48,144.53 | U6.26 U6.25 20.49,54.79 20.49,56.13 v19.99,56.64
  Top 0.508: U4.1 36.31,14.45 C7.1 C21.1 | C19.2 11.01,120.56 10.26,119.81 J1.1 | R11.1 v8.81,133.11 | U3.2 16.41,135.1 v17.19,135.89
  Top 0.61: v28.37,35.05 LS1.N 28.46,31.9 TP6.TP
  Top 0.813: R11.1 R29.1
  Bottom 1.016: J4.MTN1 J4.MTN2 | J4.MTN3 J4.MTN4
  pour Bottom (no thermals): 5,149.86 -0.08,144.78 -0.08,105.16 0.17,104.9 5,100.08 5,99.82 5,5.08 10.08,0 39.8,0 44.88,5.08 44.88,99.82 49.96,104.9 49.96,145.03 45.13,149.86
LED_G  (via drill 0.45, 0.5)
  Top 0.305: U5.14 26.15,112.96 23.54,115.57 7.79,115.57 6.78,114.55 6.78,105.92 12.11,100.71 v12.87,100.71 | v21.69,75.77 LED3.2 | v18.72,92.96 v18.72,100.71
  Bottom 0.305: v21.69,75.77 17.19,80.26 17.19,91.44 v18.72,92.96 | v18.72,100.71 v12.87,100.71
N$1
  Top 0.305: 19.52,118.92 C2.1 19.22,118.19 17.88,116.84 17.03,116.84 15.67,118.2 R2.2
  Top 0.406: 19.52,118.92 U1.3
  Top 0.508: C1.2 R2.2
N$2  (via drill 0.5)
  Top 0.406: v23.54,124.21 24.56,125.22 25.56,125.22 R4.2 | U1.1 21.59,122.35 20.49,123.44 v19.22,123.44
  Bottom 0.406: v23.54,124.21 19.99,124.21 v19.22,123.44
N$3  (via drill 0.6)
  Top 0.508: v15.64,123.44 15.64,120.94 R2.1
  Bottom 0.508: TH1.2 25.46,127.39 24.3,126.24 18.44,126.24 v15.64,123.44
N$5  (via drill 0.5)
  Top 0.305: C2.2 19.85,120.92 20.57,120.19 U1.2
  Top 0.406: C3.1 v17.45,123.44 | R3.2 28.13,123.46 28.88,124.21 v28.88,125.22
  Top 0.508: C3.1 C2.2
  Bottom 0.406: v28.88,125.22 19.22,125.22 v17.45,123.44
N$6
  Top 0.406: U2.5 41.46,123.5 R7.2
  Top 0.508: R8.1 41.51,125.12 R7.2
N$7
  Top 0.305: U1.8 25.88,121.46 25.57,121.77 25.57,123.41 R4.1
N$8
  Top 0.406: TP5.TP 26.34,115.32 25.57,116.08 25.57,118.11 26.39,118.92 U1.6
  Top 0.508: U1.6 31.2,118.92 R5.1
N$9  (via drill 0.45, 0.5)
  Top 0.305: R15.2 v37,112.67 | LS1.P 28.43,39.94 32.49,39.94 37,44.45 v37,90.93
  Bottom 0.305: v37,112.67 v37,90.93
N$10
  Top 0.305: 33.61,118.37 R5.2
  Top 0.406: R6.1 33.61,118.37
  Top 0.508: C5.1 33.53,120.23 R6.1
N$11
  Top 0.406: C6.1 37.17,122.77 35.17,124.77 U2.3
  Top 0.61: R6.2 C6.1
N$12
  Top 0.406: R13.2 20.58,106.73 21.11,107.26 U5.20
N$13  (via drill 0.5)
  Top 0.305: U6.16 26.36,56.41 26.84,56.9 v26.84,61.98
  Bottom 0.305: J4.D- 16.8,72.02 v26.84,61.98
N$14  (via drill 0.5)
  Top 0.305: U6.15 27,56.04 28.11,57.15 v28.11,61.98
  Bottom 0.305: J4.D+ 17.27,72.82 v28.11,61.98
N$15
  Top 0.406: J2.1 14.73,113.28 22.02,113.28 23.06,112.24 U5.17
N$16
  Top 0.152: 36.2,19.32 U4.6
  Top 0.305: C8.1 36.2,19.32
N$17  (via drill 0.5, 0.6)
  Top 0.406: U5.7 30.42,108.86 v30.02,108.46
  Top 0.508: Y1.2 39.54,102.87 37,105.41 37,106.93 v35.48,108.46
  Top 0.61: Y1.2 C11.2
  Bottom 0.406: v35.48,108.46 v30.02,108.46
N$18
  Top 0.406: U5.8 31.64,110.42 32.33,111.1 35.63,111.1 38.27,108.46 39.44,108.46 Y1.1
  Top 0.508: 39.44,108.46 39.63,108.65 C12.2
N$19
  Top 0.406: J2.3 12.95,114.05 22.53,114.05 24.55,112.02 U5.16
N$20
  Top 0.152: 34.3,17.96 34.04,17.7 C8.2
  Top 0.305: U4.2 37.26,17.45 36.75,17.96 34.3,17.96
  Top 0.813: L1.1 29.38,19.56 31.42,17.53 33.87,17.53 34.04,17.7
N$21
  Top 0.406: J2.5 11.17,114.81 23.03,114.81 25.35,112.49 U5.15
N$22
  Top 0.508: U4.4 38.21,21.36 R10.2 R9.1
N$23
  Top 0.508: U3.4 15.45,131.41 R29.2
  Top 0.813: R29.2 R11.2 R12.1
N$24
  Top 0.305: R19.1 20.15,57.75 21.8,56.09 U6.23
N$25  (via drill 0.45, 0.5)
  Top 0.305: J1.4 5.76,125.91 5.76,105.82 12.01,99.57 v12.87,99.57
  Top 0.406: U5.27 26.15,100.91 v24.81,99.57
  Bottom 0.305: v24.81,99.57 v12.87,99.57
N$26
  Top 0.305: R19.2 20.48,59.45
  Top 0.406: 20.48,59.45 LED1.1
N$27
  Top 0.305: U6.22 22.45,56.41 R20.1
N$28  (via drill 0.45, 0.5)
  Top 0.305: v4.9,124.89 4.9,105.51 12.01,98.42 v12.87,98.42
  Top 0.406: U5.28 26.95,100.18 26.34,99.57 v26.34,98.42
  Bottom 0.305: v26.34,98.42 v12.87,98.42
  Bottom 0.406: J1.3 v4.9,124.89
N$29
  Top 0.152: R20.2
  Top 0.305: LED2.1 23.77,59.46
  Top 0.406: 23.77,59.46 R20.2
N$30
  Top 0.305: C17.1 25.7,57.62 U6.17
N$31  (via drill 0.5)
  Top 0.305: v21.51,70.1 v17.19,70.1 | F1.1 v29.64,61.98
  Bottom 0.305: J4.VBUS 16.07,71.22 v17.19,70.1 | v29.64,61.98 v21.51,70.1
N$32
  Top 0.508: U3.1 17.34,132.99 16.43,132.08 16.43,130.81 15.67,130.05 13.89,130.05 12.95,129.1 Q1.1
N$33
  Top 0.61: C16.1 30.67,57.44 F1.2 C15.1 | C15.1 | D2.1 29.64,53.29 C15.1
N$34
  Top 0.406: U5.31 29.35,100.9 31.16,99.09 R21.1
N$35
  Top 0.406: U5.30 28.55,100.15 29.38,99.31 R22.1
N$36
  Top 0.61: R31.2 R30.1 39.12,140.88 41.6,138.41 J3.4
N$37
  Top 0.508: Q2.1 13.32,6.71 14.1,5.93 R27.1
N$38
  Top 0.406: R24.2 LED3.1
N$39
  Top 0.508: J3.5 R25.2 R26.1
N$44
  Top 0.508: Q3.1 11.34,10.17 11.34,9.92 12.37,8.89 Q2.3 12.37,5.08 13.13,4.32 17.19,4.32 17.95,5.08 R28.1 17.97,5.94 24.91,5.94 25.83,6.86 25.83,8.38 24.62,9.59 C20.1 24.62,12.53 D3.2
N$45  (via drill 0.45, 0.5)
  Top 0.305: S7.4 v31.96,67.27 | v35.99,67.31 v35.99,44.7
  Top 0.406: v30.63,16.74 D4.1
  Top 0.813: S7.3 S7.4 | D4.1 D3.1
  Bottom 0.305: v30.63,16.74 30.63,39.35 v35.98,44.7 v35.99,44.7 | v35.99,67.31 32,67.31 v31.96,67.27
PWR_IN  (via drill 0.4, 0.45, 0.5)
  Top 0.305: U5.10 29.35,112.24 31.01,113.89 v37.92,113.89 | D4.2 30.63,13.74 v30.65,13.72 | v35.23,41.53 37.94,44.25 v37.94,89.15
  Bottom 0.305: v37.92,113.89 37.94,113.87 v37.94,89.15 | v30.65,13.72 30.65,15.49 31.42,16.26 31.42,37.72 v35.23,41.53
PWR_OUT  (via drill 0.4, 0.45, 0.5)
  Top 0.305: U5.11 28.55,112.45 30.91,114.81 v39.04,114.81 | R27.2 v15.92,9.65 | v39.04,87.38 v39.04,45.97 | v26.08,9.65 26.08,11.43 26.77,12.12 v29.64,12.12
  Bottom 0.305: v39.04,114.81 v39.04,87.38 | v39.04,45.97 35.99,45.97 29.64,39.62 v29.64,12.12 | v26.08,9.65 v15.92,9.65
RESET  (via drill 0.4, 0.45, 0.5)
  Top 0.305: 11.16,103.72 D1.2 11.2,102.67 12.01,101.85 v12.87,101.85 | 11.17,105.98 R14.1 v9.06,105.97 | v3.98,105.97 3.98,135.89 5.76,137.67 8.25,137.67 S5.2 | C18.2 17.51,50.48 12.11,55.88 12.11,85.34 10.33,87.12 10.33,94.74 v12.87,97.28
  Top 0.406: R14.1 11.16,103.72 | J2.4 11.17,105.98 | U5.29 v27.75,98.42
  Bottom 0.305: v9.06,105.97 v3.98,105.97 | v12.87,101.85 26.16,101.85 27.76,100.25 v27.75,98.42 26.62,97.28 v12.87,97.28
RX  (via drill 0.45)
  Top 0.305: U6.1 18.55,50.2 12.87,55.88 12.87,85.85 11.1,87.63 11.1,94.36 v12.87,96.14 | R22.2 28.22,96.61 v27.75,96.14
  Bottom 0.305: v27.75,96.14 v12.87,96.14
TX  (via drill 0.45)
  Top 0.305: R21.2 31.16,95.76 v30.4,95 | v12.87,95 11.86,93.98 11.86,88.14 13.64,86.36 13.64,55.88 19.22,50.29 19.22,49.53 19.73,49.02 20.75,49.02 21.16,48.62 U6.5
  Bottom 0.305: v30.4,95 v12.87,95
VBAT
  Top 0.152: 31.35,4.76 S1.2
  Top 0.813: BT1.+ 31.35,4.76
VCC
  Top 0.152: 33.94,108.06 C14.1
  Top 0.406: LED1.2 LED2.2 | 33.68,106.46 C13.1
  Top 0.508: U5.6 33.94,108.06 | 20.75,7.68 R23.1 | U5.4 33.68,106.46
  Top 0.61: C14.1 C13.1 | D1.1 13.58,103.68 12.86,104.41 R14.2 12.86,108.88 J2.2
  Top 0.813: C9.1 33.91,25.5 L1.2 25.67,25.5 24.3,24.13 24.3,21.34 22.82,19.86 C20.2 22.82,8.68 21.85,7.71 R23.1 | Q3.3 17.95,9.64 R28.2 18.01,7.68 20.75,7.68 | S2.4 S2.3 19.7,78.69 20.91,77.47 26.08,77.47 | S3.4 S3.3 | S4.4 S4.3 34.3,78.57 33.19,77.47 27.86,77.47 | 26.08,77.47 26.84,77.47 | 26.84,77.47 27,77.62 S3.3 | 27.86,77.47 26.84,77.47 | L2.1 16.76,108.89 15.92,109.73 J2.2 | S3.3 27,78.38 26.08,77.47 | S3.3 27,78.33 27.86,77.47
  pour Top (no thermals): 14.91,112.52 11.86,109.47 11.86,55.37 17.19,50.04 17.19,25.4 22.53,20.07 34.97,20.07 38.02,23.11 38.02,109.47 34.97,112.52
VIN
  Top 0.152: 38.21,14.45 C7.2
  Top 0.508: U4.5 37.26,18.47 38.22,17.37 U4.3 38.21,14.45 | C21.2 C7.2 TP1.TP
  Top 0.813: C21.2 38.16,10.73 34.36,6.93 S1.3
VR  (via drill 0.45, 0.6)
  Top 0.305: U5.24 24.39,104.06 24.56,103.89 v25.32,103.89 | TH1.3 22.64,128.57 22.27,128.94 22.27,130.81 23.8,132.33 27.61,132.33 30.15,129.79 35.48,129.79 36.62,128.65 v38.66,128.65
  Top 0.508: R1.1 v20.75,128.57
  Bottom 0.305: v25.32,103.89 27.61,106.17 27.61,112.01 33.75,118.16 33.75,122.22 35.48,123.95 37.77,123.95 38.66,124.84 v38.66,128.65
  Bottom 0.508: v20.75,128.57 TH1.3
VTH  (via drill 0.6)
  Top 0.406: U2.2 33.7,126.03 33.78,126.12 U2.1
  Top 0.508: v32.94,121.93 C5.2 31.42,125.48 | U5.23 v24.8,104.86 v24.81,104.85 | 31.42,125.48 31.98,126.03 U2.2 30.17,126.03 TP7.TP 30.88,126.01 31.42,125.48
  Bottom 0.508: v32.94,121.93 32.94,118.36 26.84,112.27 26.84,106.88 v24.81,104.85

### Text on the board
tPlace: RESET | OLED | ICSP | ON/OFF | OFF | ON